# Altium schematic sheet BSPD.SchDoc
size A4
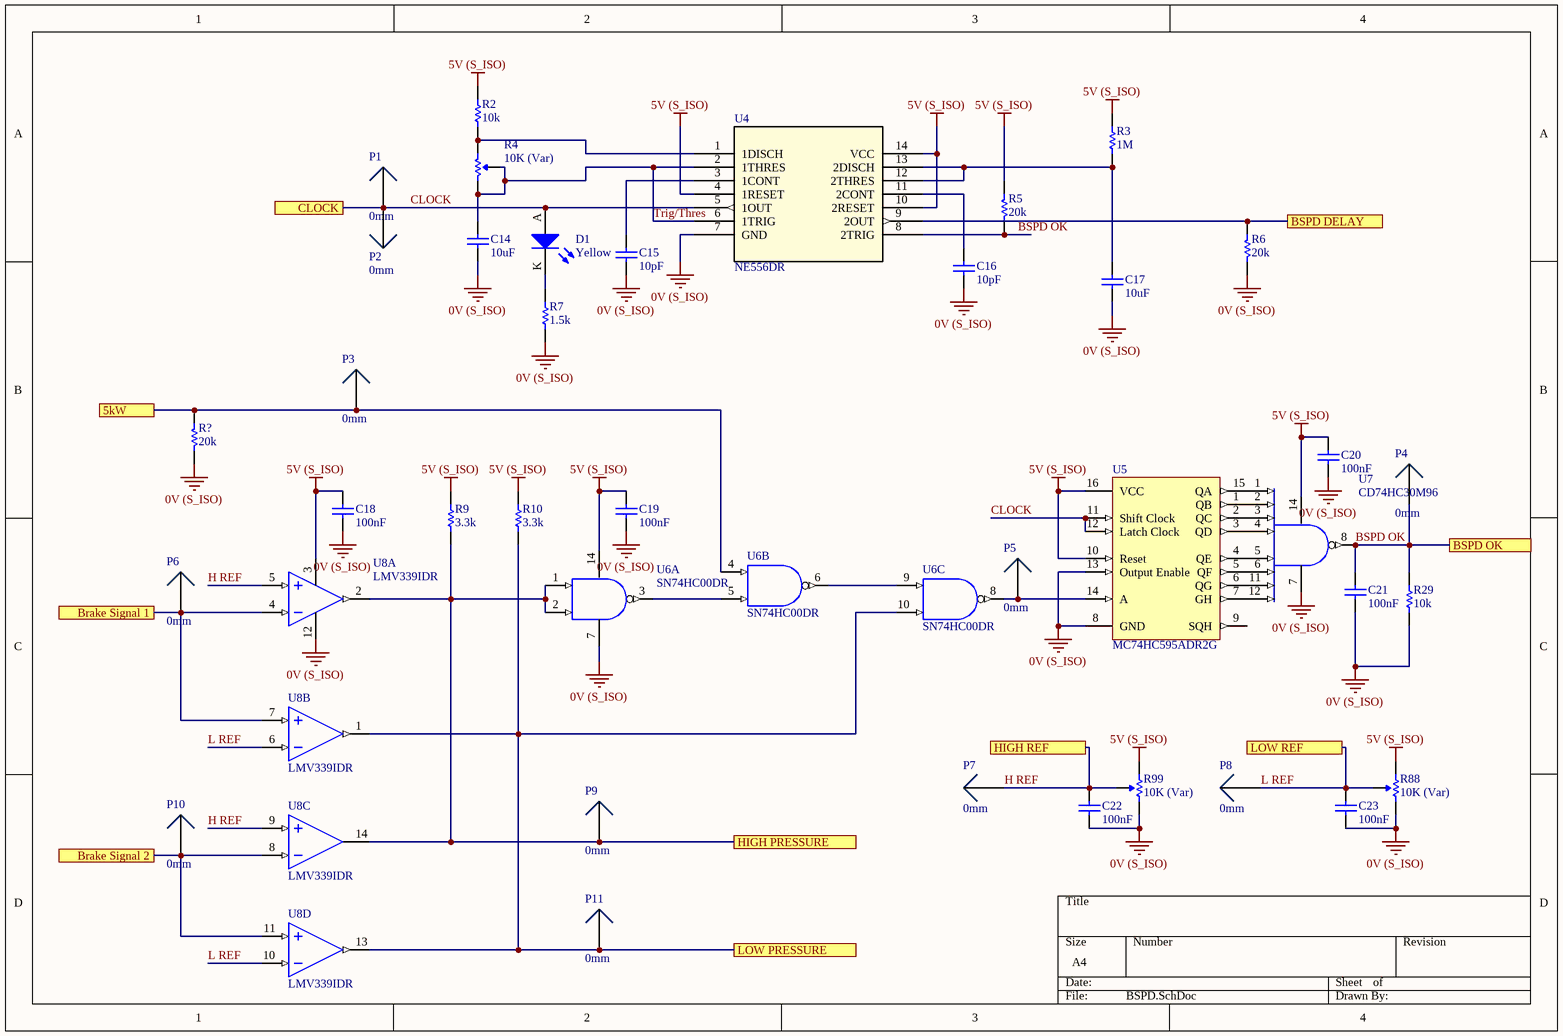
[diagram p0: BSPD.SchDoc]

## Parts
C14  10uF  [0805]
C15  10pF  [0805]
C16  10pF  [0805]
C17  10uF  [0805]
C18  100nF  [0805]
C19  100nF  [0805]
C20  100nF  [0805]
C21  100nF  [0805]
C22  100nF  [0805]
C23  100nF  [0805]
D1  Yellow  [0805 LED]
P1  0mm  [SMD Test Point]
P2  0mm  [TH Test Point]
P3  0mm  [SMD Test Point]
P4  0mm  [SMD Test Point]
P5  0mm  [SMD Test Point]
P6  0mm  [TH Test Point]
P7  0mm  [TH Test Point]
P8  0mm  [TH Test Point]
P9  0mm  [SMD Test Point]
P10  0mm  [TH Test Point]
P11  0mm  [SMD Test Point]
R2  10k  [0805]
R3  1M  [0805]
R4  10K (Var)  [B 3296]
R5  20k  [0805]
R6  20k  [0805]
R7  1.5k  [0805]
R9  3.3k  [0805]
R10  3.3k  [0805]
R29  10k  [0805]
R88  10K (Var)  [B 3296]
R99  10K (Var)  [B 3296]
R?  20k  [0805]
U4  NE556DR  [TI 14-SOIC]
U5  MC74HC595ADR2G  [ON 16-SOIC]
U6  SN74HC00DR  [TI 14-SOIC]  (parts A,B,C of 4)
U7  CD74HC30M96  [TI 14-SOIC]
U8  LMV339IDR  [TI 14-SOIC]  (parts A,B,C,D of 4)

## Ports
5kW, Brake Signal 1, Brake Signal 2, BSPD DELAY, BSPD OK, CLOCK, HIGH PRESSURE, HIGH REF, LOW PRESSURE, LOW REF

## Nets
0V (S_ISO): C14.1 C15.1 C16.1 C17.1 C18.1 C19.1 C20.1 C21.1 C22.1 C23.1 R6.2 R7.1 R29.1 R88.1(CCW) R99.1(CCW) R?.2 U4.7(GND) U5.8(GND) U5.13(Output_Enable) U6.7(GND) U7.7(GND) U8.12(V-)
5V (S_ISO): C18.2 C19.2 C20.2 R2.2 R3.2 R5.1 R9.2 R10.2 R88.3(CW) R99.3(CW) U4.4(1RESET) U4.10(2RESET) U4.14(VCC) U5.10(Reset) U5.16(VCC) U6.14(VCC) U7.14(VCC) U8.3(V+)
5kW: P3.1 R?.1 U6.4(2A) ; port 5kW
Brake Signal 1: P6.1 U8.4(IN_A-) U8.7(IN_B+) ; port Brake Signal 1
Brake Signal 2: P10.1 U8.8(IN_C-) U8.11(IN_D+) ; port Brake Signal 2
BSPD DELAY: R6.1 U4.9(2OUT) ; port BSPD DELAY
BSPD OK: C21.2 P4.1 R5.2 R29.2 U4.8(2TRIG) U7.8(Output) ; port BSPD OK
CLOCK: D1.A P1.1 P2.1 U4.5(1OUT) U5.11(Shift_Clock) U5.12(Latch_Clock) ; port CLOCK
H REF: C22.2 P7.1 R99.2(Wiper) U8.5(IN_A+) U8.9(IN_C+) ; port HIGH REF
HIGH PRESSURE: P9.1 R9.1 U6.1(1A) U6.2(1B) U8.2(OUT_A) U8.14(OUT_C) ; port HIGH PRESSURE
L REF: C23.2 P8.1 R88.2(Wiper) U8.6(IN_B-) U8.10(IN_D-) ; port LOW REF
LOW PRESSURE: P11.1 R10.1 U6.10(3B) U8.1(OUT_B) U8.13(OUT_D) ; port LOW PRESSURE
Trig/Thres: C14.2 R4.1(CCW) R4.2(Wiper) U4.2(1THRES) U4.6(1TRIG)
NetC15_2: C15.2 U4.3(1CONT)
NetC16_2: C16.2 U4.11(2CONT)
NetC17_2: C17.2 R3.1 U4.12(2THRES) U4.13(2DISCH)
NetD1_K: D1.K R7.2
NetP5_1: P5.1 U5.14(A) U6.8(3Y)
NetR2_1: R2.1 R4.3(CW) U4.1(1DISCH)
NetU5_1: U5.1(QB) U7.2(Input)
NetU5_2: U5.2(QC) U7.3(Input)
NetU5_3: U5.3(QD) U7.4(Input)
NetU5_4: U5.4(QE) U7.5(Input)
NetU5_5: U5.5(QF) U7.6(Input)
NetU5_6: U5.6(QG) U7.11(Input)
NetU5_7: U5.7(GH) U7.12(Input)
NetU5_15: U5.15(QA) U7.1(Input)
NetU6_3: U6.3(1Y) U6.5(2B)
NetU6_6: U6.6(2Y) U6.9(3A)

Not connected (* = marked no-connect by the designer): U5 9(SQH)

## Library data of the parts
C14 C17 = GRM21BR6YA106KE43L: Manufacturer: muRata; Tolerance: 10%; Material: X5R; Rated Voltage: 50V; Part Number: GRM21BR6YA106KE43L; Value: 10uF; Digikey Part Number: 490-10514-6-ND
C15 C16 = GCM21B5C1H100JA37L: Manufacturer: muRata; Tolerance: 5%; Material: C0G; Rated Voltage: 50V; Part Number: GCM21B5C1H100JA37L; Value: 10pF
C18-C23 = GCM21BR71E104KA37L: Manufacturer: muRata; Tolerance: 10%; Material: X7R; Rated Voltage: 25V; Part Number: GCM21BR71E104KA37L; Value: 100nF
D1 = SML-211YTT86: Yellow LED Indication - Discrete 1.75V 0805 (2012 Metric); Manufacturer: ROHM Semiconductor; Part Number: SML-211YTT86; Colour: Yellow; Digikey Part Number: 511-1293-1-ND; Digikey Link: https://www.digikey.com/product-detail/en/rohm-semiconductor/SML-211YTT86/511-1293-1-ND/637106
P1 P3-P5 P9 P11 = SMD Test Point: Positions: 1; Row Spacing: 0; Flange: No; Contact: NA; Part Number: SMD Test Point; Pitch: 0mm; Angle: 0
P2 P6-P8 P10 = TH Test Point: Positions: 1; Angle: 0; Flange: No; Contact: NA; Part Number: TH Test Point; Pitch: 0mm; Row Spacing: 0mm
R2 R29 = RC0805FR0710KL: Manufacturer: YAGEO; Tolerance: 0.01; Rated Voltage: 0.125W; Part Number: RC0805FR0710KL; Value: 10k; Material: FR-07
R3 = RC0805FR071ML: Manufacturer: YAGEO; Tolerance: 0.01; Rated Voltage: 0.125W; Part Number: RC0805FR071ML; Value: 1M; Material: FR-07
R4 R88 R99 = 3296W-1-103LF: Manufacturer: Bournes Inc; Tolerance: 0.1; Rated Voltage: 0.5W; Part Number: 3296W-1-103LF; Value: 10K (Var); Digikey Part Number: 3296W-103LF-ND
R5 R6 R? = RC0805FR0720KL: Manufacturer: YAGEO; Tolerance: 0.01; Rated Voltage: 0.125W; Part Number: RC0805FR0720KL; Value: 20k; Material: FR-07
R7 = RC0805FR071K5L: Manufacturer: YAGEO; Tolerance: 0.01; Rated Voltage: 0.125W; Part Number: RC0805FR071K5L; Value: 1.5k; Material: FR-07
R9 R10 = RC0805FR073K3L: Manufacturer: YAGEO; Tolerance: 0.01; Rated Voltage: 0.125W; Part Number: RC0805FR073K3L; Value: 3.3k; Material: FR-07
U4 = NE556DR: IC OSC TIMER DUAL 100KHZ 14SOIC; Manufacturer: Texas Instruments; Part Number: NE556DR; Digikey Part Number: 296-26240-1-ND; Digikey Link: https://www.digikey.com/product-detail/en/texas-instruments/NE556DR/296-26240-1-ND/2254905
U5 = MC74HC595ADR2G: IC SHIFT REGISTR 8BIT 3ST 16SOIC; Manufacturer: ON Semiconductor; Part Number: MC74HC595ADR2G; Digikey Part Number: MC74HC595ADR2GOSCT-ND; Digikey Link: https://www.digikey.com/product-detail/en/on-semiconductor/MC74HC595ADR2G/MC74HC595ADR2GOSCT-ND/1139727
U6 = SN74HC00DR: NAND Gate IC 4 Channel 14-SOIC; Manufacturer: Texas Instruments; Part Number: SN74HC00DR; Digikey Part Number: 296-1187-2-ND; Digikey Link: https://www.digikey.com.au/product-detail/en/texas-instruments/SN74HC00DR/296-1187-2-ND/276830
U7 = CD74HC30M96: IC GATE NAND 1CH 8-INP 14SOIC; Manufacturer: Texas Instruments; Part Number: CD74HC30M96; Digikey Part Number: 296-14521-1-ND; Digikey Link: https://www.digikey.com/product-detail/en/texas-instruments/CD74HC30M96/296-14521-1-ND/555580
U8 = LMV339IDR: Comparator General Purpose Open Collector 14-SOIC; Manufacturer: Texas Instruments; Part Number: LMV339IDR; Digikey Part Number: 296-6611-2-ND; Digikey Link: https://www.digikey.com/product-detail/en/texas-instruments/LMV339MTX-NOPB/296-35446-1-ND/3739150